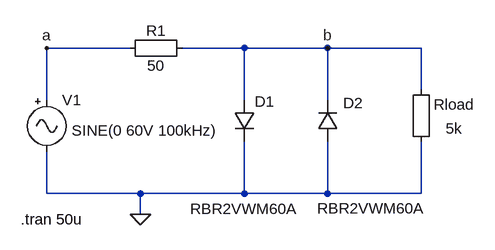
[diagram p0: schematic Diode-Clipper-5.asc]
Diode-Clipper-5.asc, the LTspice schematic file:
Version 4
SHEET 1 880 680
WIRE 32 144 -96 144
WIRE 208 144 112 144
WIRE 336 144 208 144
WIRE 480 144 336 144
WIRE 480 208 480 144
WIRE -96 224 -96 144
WIRE 208 224 208 144
WIRE 336 224 336 144
WIRE -96 368 -96 304
WIRE 48 368 -96 368
WIRE 208 368 208 288
WIRE 208 368 48 368
WIRE 336 368 336 288
WIRE 336 368 208 368
WIRE 480 368 480 288
WIRE 480 368 336 368
WIRE 48 400 48 368
FLAG -96 144 a
FLAG 336 144 b
FLAG 48 400 0
SYMBOL diode 352 288 R180
WINDOW 0 -39 59 Left 2
WINDOW 3 -133 -103 Left 2
SYMATTR InstName D2
SYMATTR Value RBR2VWM60A
SYMBOL Misc\\signal -96 208 R0
WINDOW 123 0 0 Left 2
WINDOW 39 0 0 Left 2
WINDOW 3 38 63 Left 2
SYMATTR Value SINE(0 60V 100kHz)
SYMATTR InstName V1
SYMBOL Misc\\EuropeanResistor 128 128 R90
WINDOW 0 5 56 VBottom 2
WINDOW 3 27 56 VTop 2
SYMATTR InstName R1
SYMATTR Value 50
SYMBOL diode 192 224 R0
WINDOW 3 -67 168 Left 2
WINDOW 0 32 2 Left 2
SYMATTR Value RBR2VWM60A
SYMATTR InstName D1
SYMBOL Misc\\EuropeanResistor 496 304 R180
WINDOW 0 -66 73 Left 2
WINDOW 3 -47 36 Left 2
SYMATTR InstName Rload
SYMATTR Value 5k
TEXT -136 408 Left 2 !.tran 50u

The netlist it stands for:
* Diode-Clipper-5.asc
D2 0 b RBR2VWM60A
V1 a 0 SINE(0 60V 100kHz)
R1 b a 50
D1 b 0 RBR2VWM60A
Rload 0 b 5k
.model D D
.lib standard.dio
.tran 50u
.backanno
.end